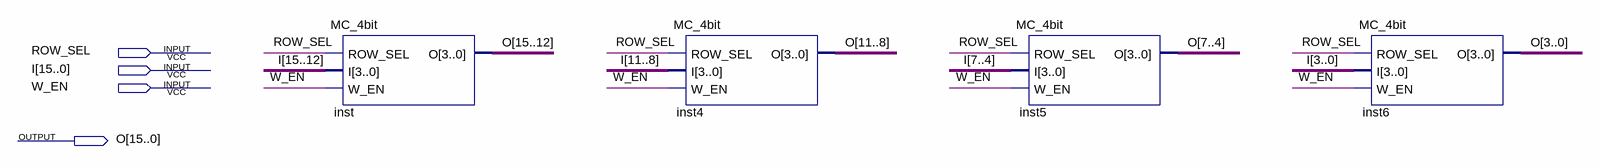
[diagram p0: schematic sheet]
// Quartus schematic MC_16bit.bdf as structural Verilog: 4 symbols, 4 pins
module MC_16bit (
  input  ROW_SEL,
  input  [15:0] I,
  input  W_EN,
  output [15:0] O
);

  MC_4bit inst (.ROW_SEL(ROW_SEL), .I(I[15:12]), .W_EN(W_EN), .O(O[15:12]));
  MC_4bit inst4 (.ROW_SEL(ROW_SEL), .I(I[11:8]), .W_EN(W_EN), .O(O[11:8]));
  MC_4bit inst5 (.ROW_SEL(ROW_SEL), .I(I[7:4]), .W_EN(W_EN), .O(O[7:4]));
  MC_4bit inst6 (.ROW_SEL(ROW_SEL), .I(I[3:0]), .W_EN(W_EN), .O(O[3:0]));
endmodule
